# EAGLE schematic Primary (EAGLE 5.12)

## Sheet 1 of 4
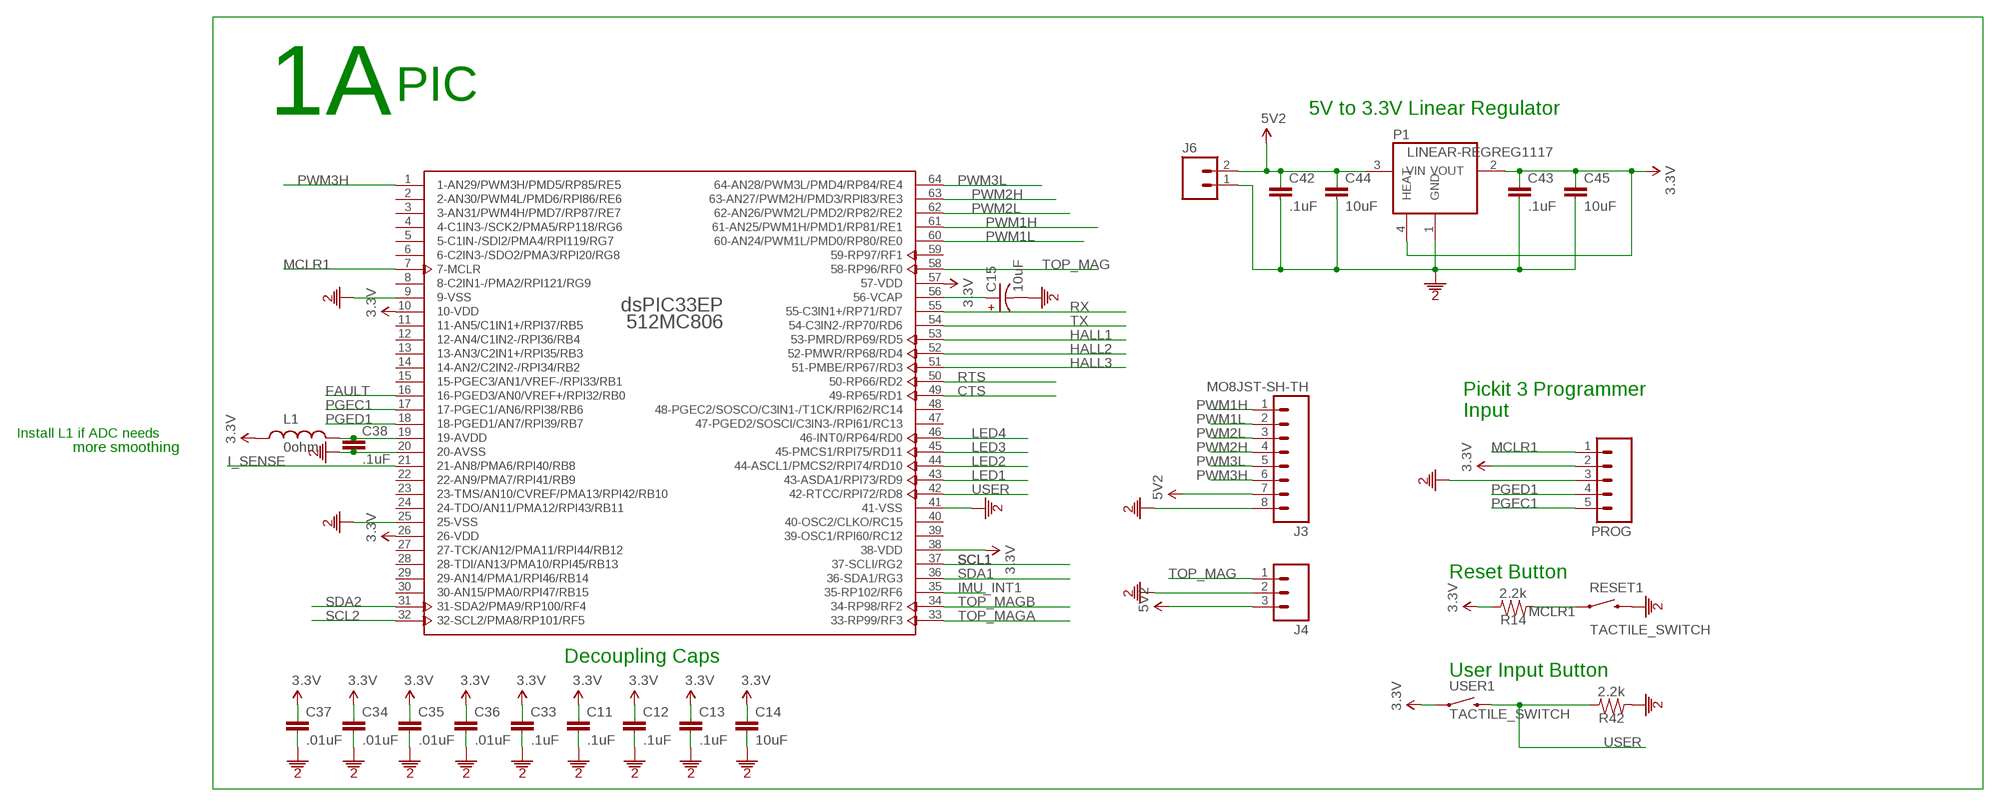
[diagram p0: schematic, sheet 1]

### Parts
C11  .1uF  CAP0603  [0603]
C12  .1uF  CAP0603  [0603]
C13  .1uF  CAP0603  [0603]
C14  10uF  CAP1206  [1206]
C15  10uF  CAP-POL0603  [0603-POL]
C33  .1uF  CAP0603  [0603]
C34  .01uF  CAP0603  [0603]
C35  .01uF  CAP0603  [0603]
C36  .01uF  CAP0603  [0603]
C37  .01uF  CAP0603  [0603]
C38  .1uF  CAP0603  [0603]
C42  .1uF  CAP0603  [0603]
C43  .1uF  CAP0603  [0603]
C44  10uF  CAP1206  [1206]
C45  10uF  CAP1206  [1206]
J3  MO8JST-SH-TH  MO8JST-PH-TH  [JST-8-PH-TH]
J4  M03PH-TH  [JST-3-PH-TH]
J6  M02JST-2-PH-TH  [JST-2-PH-TH]
L1  0ohm  INDUCTOR0603  [0603]
P1  LINEAR-REGREG1117  LINEAR-REG1117  [SOT223]
PIC1  DSPIC33EP512MC806  [TQFP64_10X10]
PROG  M05PTH  [1X05]
R14  2.2k  R0603  [0603]
R42  2.2k  R0603  [0603]
RESET1  TACTILE_SWITCH  [TACTILE_SWITCH]
USER1  TACTILE_SWITCH  [TACTILE_SWITCH]

### Nets
3.3V: C11.1 C12.1 C13.1 C14.1 C33.1 C34.1 C35.1 C36.1 C37.1 C43.1 C45.1 L1.1 P1.2(VOUT) P1.4(HEAT) PIC1.10(10-VDD) PIC1.26(26-VDD) PIC1.38(38-VDD) PIC1.57(57-VDD) PROG.2 R14.2 USER1.1 ; also sheet 2
5V2: C42.1 C44.1 J3.7 J4.3 J6.2 P1.3(VIN) ; also sheet 2,3,4
CTS: PIC1.49(49-RP65/RD1) ; also sheet 2
FAULT: PIC1.16(16-PGED3/AN0/VREF+/RPI32/RB0) ; also sheet 2
GND2: C11.2 C12.2 C13.2 C14.2 C15.- C33.2 C34.2 C35.2 C36.2 C37.2 C38.2 C42.2 C43.2 C44.2 C45.2 J3.8 J4.2 J6.1 P1.1(GND) PIC1.9(9-VSS) PIC1.20(20-AVSS) PIC1.25(25-VSS) PIC1.41(41-VSS) PROG.3 R42.1 RESET1.2 ; also sheet 2,3,4
HALL1: PIC1.53(53-PMRD/RP69/RD5) ; also sheet 2
HALL2: PIC1.52(52-PMWR/RP68/RD4) ; also sheet 2
HALL3: PIC1.51(51-PMBE/RP67/RD3) ; also sheet 2
I_SENSE: PIC1.21(21-AN8/PMA6/RPI40/RB8) ; also sheet 2
IMU_INT1: PIC1.35(35-RP102/RF6) ; also sheet 2
LED1: PIC1.43(43-ASDA1/RPI73/RD9) ; also sheet 2
LED2: PIC1.44(44-ASCL1/PMCS2/RPI74/RD10) ; also sheet 2
LED3: PIC1.45(45-PMCS1/RPI75/RD11) ; also sheet 2
LED4: PIC1.46(46-INT0/RP64/RD0) ; also sheet 2
MCLR1: PIC1.7(7-MCLR) PROG.1 R14.1 RESET1.1
N$15: C38.1 L1.2 PIC1.19(19-AVDD)
N$16: C15.+ PIC1.56(56-VCAP)
PGEC1: PIC1.17(17-PGEC1/AN6/RPI38/RB6) PROG.5
PGED1: PIC1.18(18-PGED1/AN7/RPI39/RB7) PROG.4
PWM1H: J3.1 PIC1.61(61-AN25/PWM1H/PMD1/RP81/RE1) ; also sheet 4
PWM1L: J3.2 PIC1.60(60-AN24/PWM1L/PMD0/RP80/RE0) ; also sheet 4
PWM2H: J3.4 PIC1.63(63-AN27/PWM2H/PMD3/RPI83/RE3) ; also sheet 4
PWM2L: J3.3 PIC1.62(62-AN26/PWM2L/PMD2/RP82/RE2) ; also sheet 4
PWM3H: J3.6 PIC1.1(1-AN29/PWM3H/PMD5/RP85/RE5) ; also sheet 4
PWM3L: J3.5 PIC1.64(64-AN28/PWM3L/PMD4/RP84/RE4) ; also sheet 4
RTS: PIC1.50(50-RP66/RD2) ; also sheet 2
RX: PIC1.55(55-C3IN1+/RP71/RD7) ; also sheet 2
SCL1: PIC1.37(37-SCLI/RG2) ; also sheet 2
SCL2: PIC1.32(32-SCL2/PMA8/RP101/RF5) ; also sheet 2
SDA1: PIC1.36(36-SDA1/RG3) ; also sheet 2
SDA2: PIC1.31(31-SDA2/PMA9/RP100/RF4) ; also sheet 2
TOP_MAG: J4.1 PIC1.58(58-RP96/RF0) ; also sheet 4
TOP_MAGA: PIC1.33(33-RP99/RF3) ; also sheet 2
TOP_MAGB: PIC1.34(34-RP98/RF2) ; also sheet 2
TX: PIC1.54(54-C3IN2-/RP70/RD6) ; also sheet 2
USER: PIC1.42(42-RTCC/RPI72/RD8) R42.2 USER1.2
Unconnected: PIC1.2(2-AN30/PWM4L/PMD6/RPI86/RE6) PIC1.3(3-AN31/PWM4H/PMD7/RP87/RE7) PIC1.4(4-C1IN3-/SCK2/PMA5/RP118/RG6) PIC1.5(5-C1IN-/SDI2/PMA4/RPI119/RG7) PIC1.6(6-C2IN3-/SDO2/PMA3/RPI20/RG8) PIC1.8(8-C2IN1-/PMA2/RPI121/RG9) PIC1.11(11-AN5/C1IN1+/RPI37/RB5) PIC1.12(12-AN4/C1IN2-/RPI36/RB4) PIC1.13(13-AN3/C2IN1+/RPI35/RB3) PIC1.14(14-AN2/C2IN2-/RPI34/RB2) PIC1.15(15-PGEC3/AN1/VREF-/RPI33/RB1) PIC1.22(22-AN9/PMA7/RPI41/RB9) PIC1.23(23-TMS/AN10/CVREF/PMA13/RPI42/RB10) PIC1.24(24-TDO/AN11/PMA12/RPI43/RB11) PIC1.27(27-TCK/AN12/PMA11/RPI44/RB12) PIC1.28(28-TDI/AN13/PMA10/RPI45/RB13) PIC1.29(29-AN14/PMA1/RPI46/RB14) PIC1.30(30-AN15/PMA0/RPI47/RB15) PIC1.39(39-OSC1/RPI60/RC12) PIC1.40(40-OSC2/CLKO/RC15) PIC1.47(47-PGED2/SOSCI/C3IN3-/RPI61/RC13) PIC1.48(48-PGEC2/SOSCO/C3IN1-/T1CK/RPI62/RC14) PIC1.59(59-RP97/RF1)

### Notes on the sheet
- 1 | A | PIC
- 5V to 3.3V Linear Regulator
- Pickit 3 Programmer
- Input
- Install L1 if ADC needs
- more smoothing
- Reset Button
- Decoupling Caps
- User Input Button

## Sheet 2 of 4
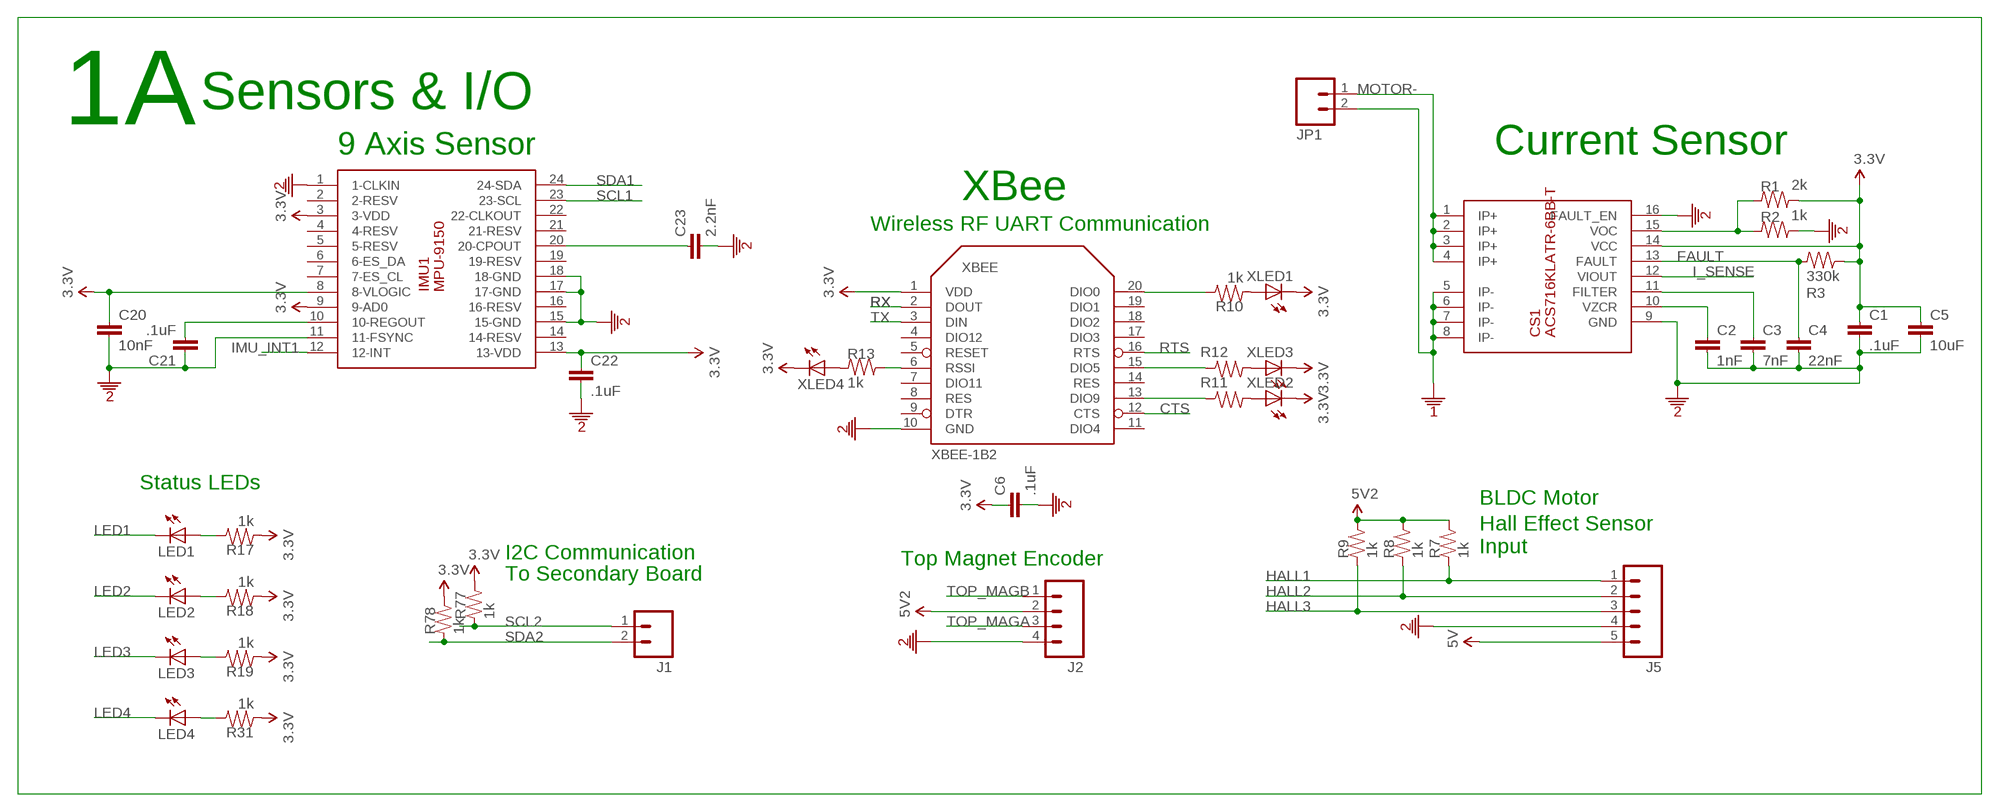
[diagram p1: schematic, sheet 2]

### Parts
C1  .1uF  CAP0603  [0603]
C2  1nF  CAP0603  [0603]
C3  7nF  CAP0603  [0603]
C4  22nF  CAP0603  [0603]
C5  10uF  CAP0603  [0603]
C6  .1uF  CAP1206  [1206]
C20  10nF  CAP0603  [0603]
C21  .1uF  CAP0603  [0603]
C22  .1uF  CAP0603  [0603]
C23  2.2nF  CAP0603  [0603]
CS1  ACS716KLATR-6BB-T  ACS716  [SOIC16-W]
IMU1  MPU-9150  [LGA24_4X4]
J1  M02JST-2-PH-TH  [JST-2-PH-TH]
J2  M04PH-TH  [JST-4-PH-TH]
J5  M05JST-SH  [JST-SH-5]
JP1  M02MINIFITJR  [MOLEX-2-MINIFITJR-RA]
LED1  LED0603  [0603-DIODE]
LED2  LED0603  [0603-DIODE]
LED3  LED0603  [0603-DIODE]
LED4  LED0603  [0603-DIODE]
R1  2k  R0603  [0603]
R2  1k  R0603  [0603]
R3  330k  R0603  [0603]
R7  1k  R0603  [0603]
R8  1k  R0603  [0603]
R9  1k  R0603  [0603]
R10  1k  R0603  [0603]
R11  1k  R0603  [0603]
R12  1k  R0603  [0603]
R13  1k  R0603  [0603]
R17  1k  R0603  [0603]
R18  1k  R0603  [0603]
R19  1k  R0603  [0603]
R31  1k  R0603  [0603]
R77  1k  R0603  [0603]
R78  1k  R0603  [0603]
XBEE  XBEE-1B2  [XBEE-SILK]
XLED1  LED0603  [0603-DIODE]
XLED2  LED0603  [0603-DIODE]
XLED3  LED0603  [0603-DIODE]
XLED4  LED0603  [0603-DIODE]

### Nets
3.3V: C1.1 C5.1 C6.1 C20.1 C22.1 CS1.14(VCC) IMU1.3(3-VDD) IMU1.8(8-VLOGIC) IMU1.9(9-AD0) IMU1.13(13-VDD) R1.2 R3.2 R17.1 R18.1 R19.1 R31.1 R77.2 R78.2 XBEE.1(VDD) XLED1.CAT(C) XLED2.CAT(C) XLED3.CAT(C) XLED4.CAT(C) ; also sheet 1
5V2: J2.2 J5.5 R7.2 R8.2 R9.2 ; supply symbol labelled 5V ; also sheet 1,3,4
CTS: XBEE.12(CTS) ; also sheet 1
FAULT: C4.1 CS1.13(FAULT) R3.1 ; also sheet 1
GND1: CS1.5(IP-) CS1.6(IP-) CS1.7(IP-) CS1.8(IP-) JP1.2 ; also sheet 3,4
GND2: C1.2 C2.2 C3.2 C4.2 C5.2 C6.2 C20.2 C21.1 C22.2 C23.2 CS1.9(GND) CS1.16(FAULT_EN) IMU1.1(1-CLKIN) IMU1.11(11-FSYNC) IMU1.15(15-GND) IMU1.17(17-GND) IMU1.18(18-GND) J2.4 J5.4 R2.2 XBEE.10(GND) ; also sheet 1,3,4
HALL1: J5.1 R7.1 ; also sheet 1
HALL2: J5.2 R8.1 ; also sheet 1
HALL3: J5.3 R9.1 ; also sheet 1
I_SENSE: CS1.12(VIOUT) ; also sheet 1
IMU_INT1: IMU1.12(12-INT) ; also sheet 1
LED1: LED1.CAT(C) ; also sheet 1
LED2: LED2.CAT(C) ; also sheet 1
LED3: LED3.CAT(C) ; also sheet 1
LED4: LED4.CAT(C) ; also sheet 1
MOTOR-: CS1.1(IP+) CS1.2(IP+) CS1.3(IP+) CS1.4(IP+) JP1.1 ; also sheet 4
N$4: R11.2 XBEE.13(DIO9)
N$5: CS1.15(VOC) R1.1 R2.1
N$7: C2.1 CS1.10(VZCR)
N$8: C3.1 CS1.11(FILTER)
N$9: R10.2 XBEE.20(DIO0)
N$10: R10.1 XLED1.AN(A)
N$11: LED1.AN(A) R17.2
N$12: LED2.AN(A) R18.2
N$13: LED3.AN(A) R19.2
N$17: LED4.AN(A) R31.2
N$24: C21.2 IMU1.10(10-REGOUT)
N$25: C23.1 IMU1.20(20-CPOUT)
N$27: R11.1 XLED2.AN(A)
N$30: R12.2 XBEE.15(DIO5)
N$31: R12.1 XLED3.AN(A)
N$32: R13.2 XBEE.6(RSSI)
N$39: R13.1 XLED4.AN(A)
RTS: XBEE.16(RTS) ; also sheet 1
RX: XBEE.2(DOUT) ; also sheet 1
SCL1: IMU1.23(23-SCL) ; also sheet 1
SCL2: J1.1 R77.1 ; also sheet 1
SDA1: IMU1.24(24-SDA) ; also sheet 1
SDA2: J1.2 R78.1 ; also sheet 1
TOP_MAGA: J2.3 ; also sheet 1
TOP_MAGB: J2.1 ; also sheet 1
TX: XBEE.3(DIN) ; also sheet 1
Unconnected: IMU1.2(2-RESV) IMU1.4(4-RESV) IMU1.5(5-RESV) IMU1.6(6-ES_DA) IMU1.7(7-ES_CL) IMU1.14(14-RESV) IMU1.16(16-RESV) IMU1.19(19-RESV) IMU1.21(21-RESV) IMU1.22(22-CLKOUT) XBEE.4(DIO12) XBEE.5(RESET) XBEE.7(DIO11) XBEE.8(RES) XBEE.9(DTR) XBEE.11(DIO4) XBEE.14(RES) XBEE.17(DIO3) XBEE.18(DIO2) XBEE.19(DIO1)

### Notes on the sheet
- 1 | A | Sensors & I/O
- 9 Axis Sensor | Current Sensor
- XBee
- Wireless RF UART Communication
- Status LEDs
- BLDC Motor
- Hall Effect Sensor
- I2C Communication | Input
- Top Magnet Encoder
- To Secondary Board

## Sheet 3 of 4
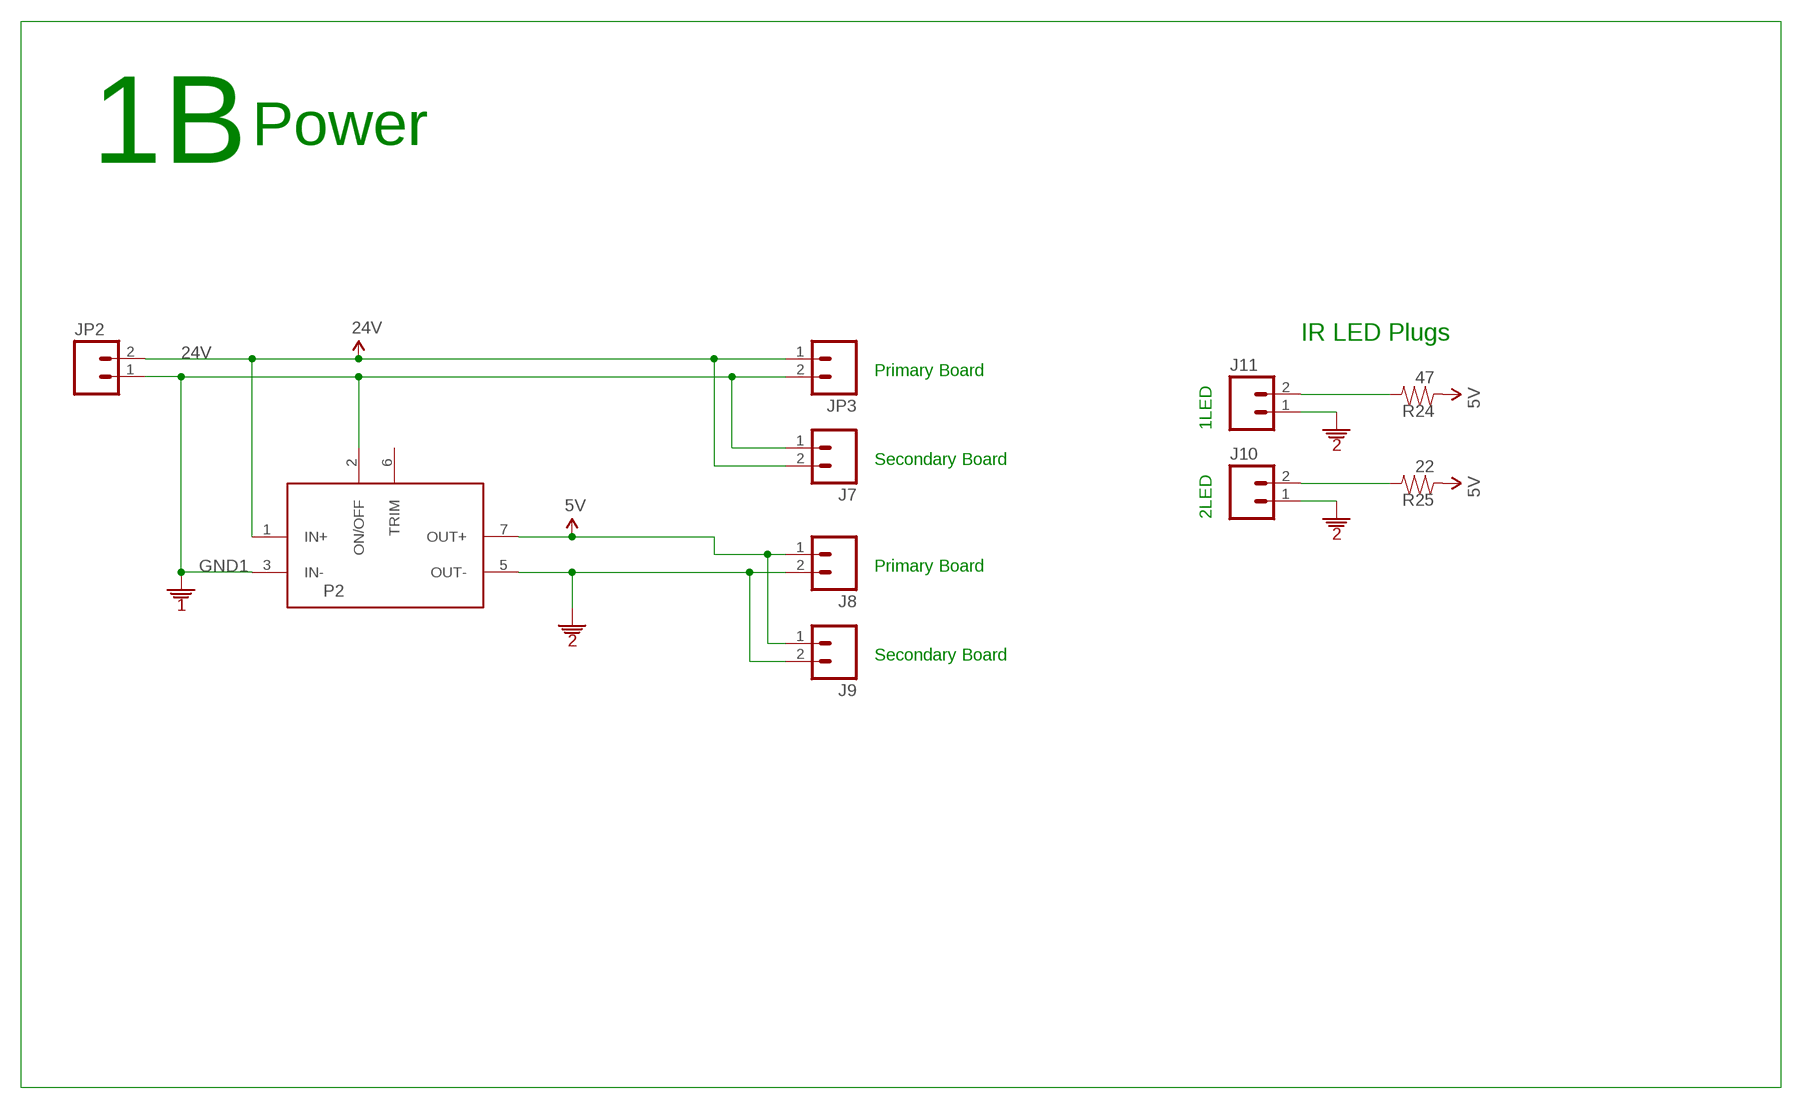
[diagram p2: schematic, sheet 3]

### Parts
J7  M02JST-2-PH-TH  [JST-2-PH-TH]
J8  M02JST-2-PH-TH  [JST-2-PH-TH]
J9  M02JST-2-PH-TH  [JST-2-PH-TH]
J10  M02JST-SH  [JST-SH-2]
J11  M02JST-SH  [JST-SH-2]
JP2  M02MINIFITJR  [MOLEX-2-MINIFITJR-RA]
JP3  M02MINIFITJR  [MOLEX-2-MINIFITJR-RA]
P2  CC10-2405SF-E  DC-DC-CONVERTER2A  [CC10-2405SF-E]
R24  47  R0603  [0603]
R25  22  R0603  [0603]

### Nets
5V2: J8.1 J9.1 P2.7(OUT+) R24.1 R25.1 ; supply symbol labelled 5V ; also sheet 1,2,4
24V: J7.2 JP2.2 JP3.1 P2.1(IN+) ; also sheet 4
GND1: J7.1 JP2.1 JP3.2 P2.2(ON/OFF) P2.3(IN-) ; also sheet 2,4
GND2: J8.2 J9.2 J10.1 J11.1 P2.5(OUT-) ; also sheet 1,2,4
N$18: J11.2 R24.2
N$19: J10.2 R25.2
Unconnected: P2.6(TRIM)

### Notes on the sheet
- 1 | B | Power
- IR LED Plugs
- Primary Board
- 1LED
- Secondary Board
- 2LED
- Primary Board
- Secondary Board

## Sheet 4 of 4
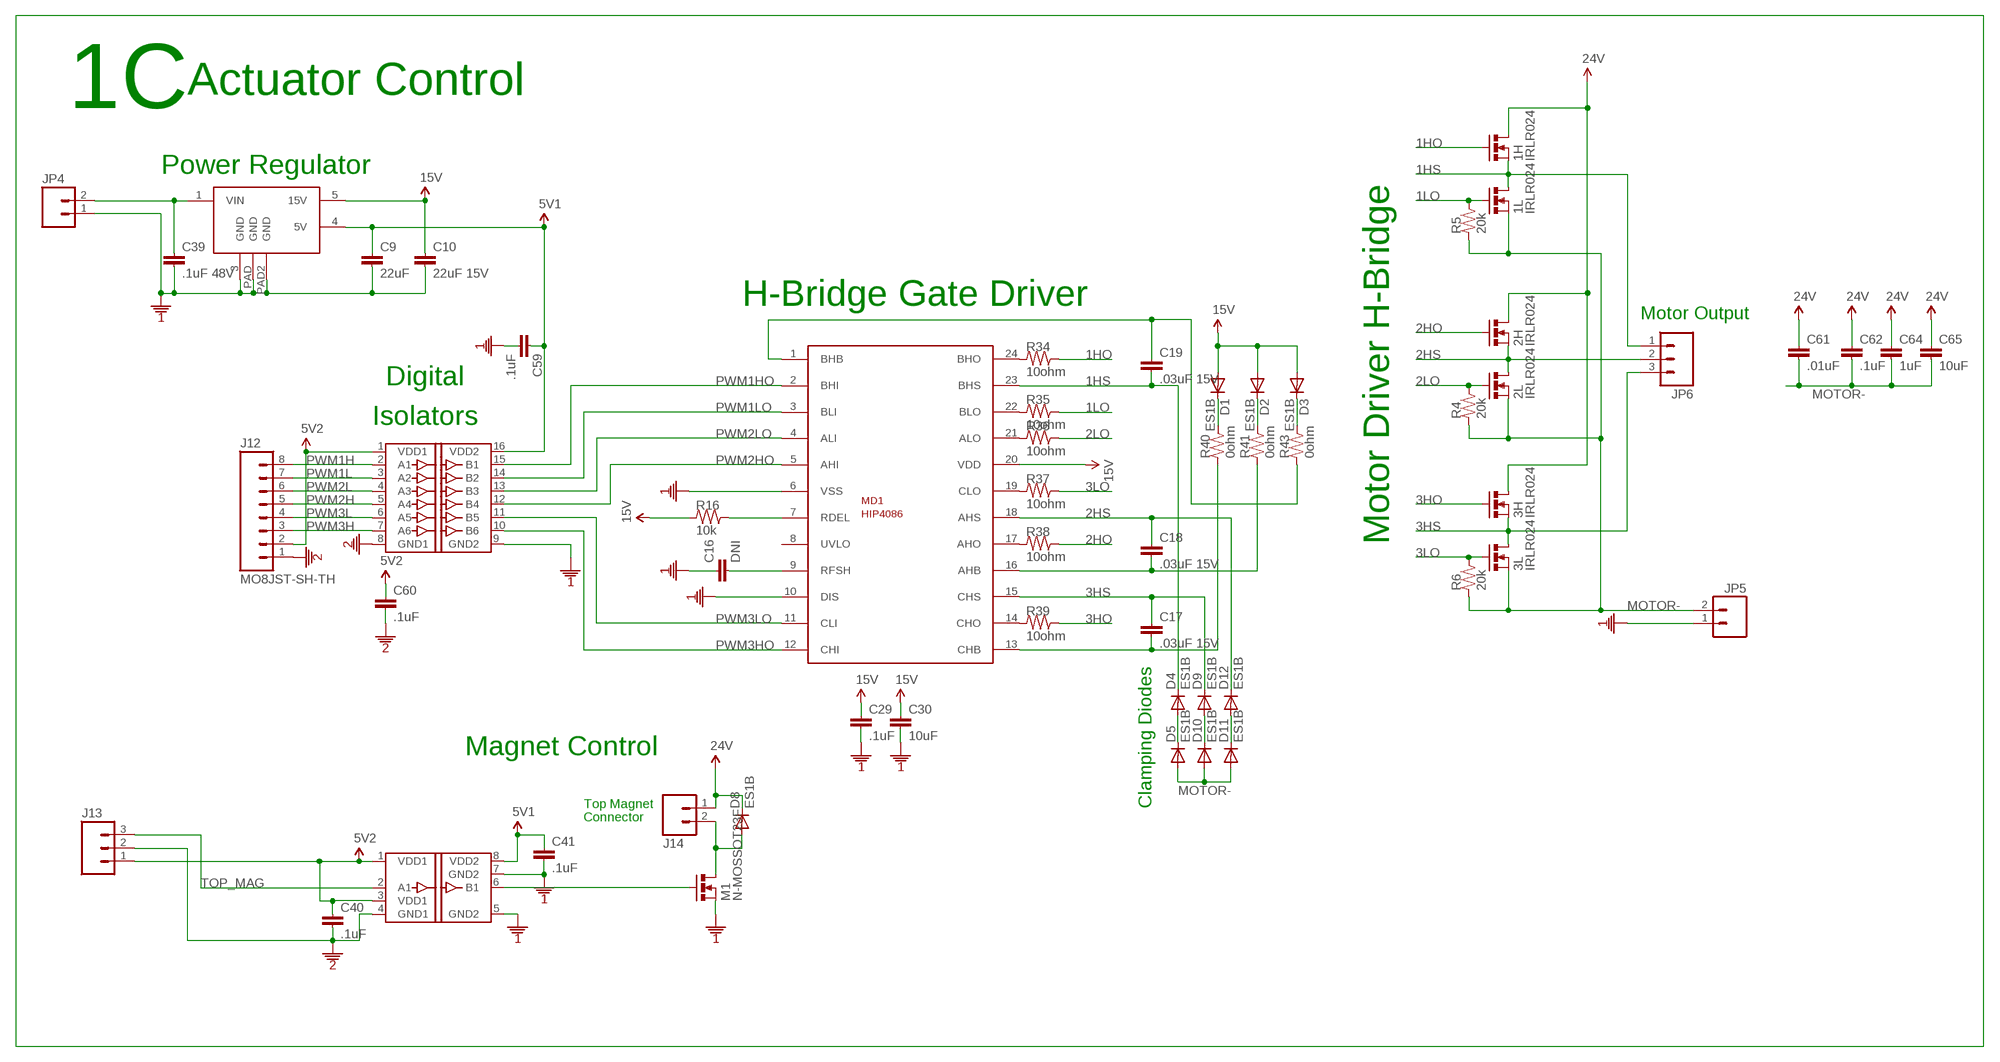
[diagram p3: schematic, sheet 4]

### Parts
1H  IRLR024  N-MOSDPAK  [DPAK]
1L  IRLR024  N-MOSDPAK  [DPAK]
2H  IRLR024  N-MOSDPAK  [DPAK]
2L  IRLR024  N-MOSDPAK  [DPAK]
3H  IRLR024  N-MOSDPAK  [DPAK]
3L  IRLR024  N-MOSDPAK  [DPAK]
C9  22uF  CAP0603  [0603]
C10  22uF 15V  CAP0603  [0603]
C16  DNI  CAP0603  [0603]
C17  .03uF 15V  CAP0603  [0603]
C18  .03uF 15V  CAP0603  [0603]
C19  .03uF 15V  CAP0603  [0603]
C29  .1uF  CAP0603  [0603]
C30  10uF  CAP0603  [0603]
C39  .1uF 48V  CAP0603  [0603]
C40  .1uF  CAP0603  [0603]
C41  .1uF  CAP0603  [0603]
C59  .1uF  CAP0603  [0603]
C60  .1uF  CAP0603  [0603]
C61  .01uF  CAP0603  [0603]
C62  .1uF  CAP0603  [0603]
C64  1uF  CAP1206  [1206]
C65  10uF  CAP1206  [1206]
D1  ES1B  DIODESMA  [SMA-DIODE@1]
D2  ES1B  DIODESMA  [SMA-DIODE@1]
D3  ES1B  DIODESMA  [SMA-DIODE@1]
D4  ES1B  DIODESMA  [SMA-DIODE@1]
D5  ES1B  DIODESMA  [SMA-DIODE@1]
D8  ES1B  DIODESMA  [SMA-DIODE@1]
D9  ES1B  DIODESMA  [SMA-DIODE@1]
D10  ES1B  DIODESMA  [SMA-DIODE@1]
D11  ES1B  DIODESMA  [SMA-DIODE@1]
D12  ES1B  DIODESMA  [SMA-DIODE@1]
DI1  DIGITAL-ISOLATOR-6CH  [SOIC16-N]
DI2  DIGITAL-ISOLATOR-1CHSOIC8-N  [SOIC8-N]
J12  MO8JST-SH-TH  MO8JST-PH-TH  [JST-8-PH-TH]
J13  M03PH-TH  [JST-3-PH-TH]
J14  M02JST-2-PH-TH  [JST-2-PH-TH]
JP4  M02MINIFITJR  [MOLEX-2-MINIFITJR-RA]
JP5  M02MINIFITJR  [MOLEX-2-MINIFITJR-RA]
JP6  M03MINIFITJR  [MOLEX-3-MINIFITJR-RA]
M1  N-MOSSOT23F  [SOT23F]
MD1  HIP4086  [SOIC24-W]
P3  IFX21004TNV51  [TO220-5]
R4  20k  R0603  [0603]
R5  20k  R0603  [0603]
R6  20k  R0603  [0603]
R16  10k  R0603  [0603]
R34  10ohm  R0603  [0603]
R35  10ohm  R0603  [0603]
R36  10ohm  R0603  [0603]
R37  10ohm  R0603  [0603]
R38  10ohm  R0603  [0603]
R39  10ohm  R0603  [0603]
R40  0ohm  R0603  [0603]
R41  0ohm  R0603  [0603]
R43  0ohm  R0603  [0603]

### Nets
1HO: 1H.G R34.2
1HS: 1H.S 1L.D C19.2 D4.C JP6.1 MD1.23(BHS)
1LO: 1L.G R5.2 R35.2
2HO: 2H.G R38.2
2HS: 2H.S 2L.D C18.1 D12.C JP6.2 MD1.18(AHS)
2LO: 2L.G R4.2 R36.2
3HO: 3H.G R39.2
3HS: 3H.S 3L.D C17.1 D9.C JP6.3 MD1.15(CHS)
3LO: 3L.G R6.2 R37.2
5V1: C9.1 C41.1 C59.1 DI1.16(VDD2) DI2.8(VDD2) P3.4(5V)
5V2: C40.1 C60.1 DI1.1(VDD1) DI2.1(VDD1) DI2.3(VDD1) J12.2 J13.1 ; also sheet 1,2,3
15V: C10.1 C29.1 C30.1 D1.A D2.A D3.A MD1.20(VDD) P3.5(15V) R16.1
24V: 1H.D 2H.D 3H.D C39.1 C61.1 C62.1 C64.1 C65.1 D8.C J14.1 JP4.2 P3.1(VIN) ; also sheet 3
GND1: C9.2 C10.2 C16.1 C29.2 C30.2 C39.2 C41.2 C59.2 DI1.9(GND2) DI2.5(GND2) DI2.7(GND2) JP4.1 JP5.1 M1.S MD1.6(VSS) MD1.10(DIS) P3.3(GND) P3.PAD2(GND) P3.PAD(GND) ; also sheet 2,3
GND2: C40.2 C60.2 DI1.8(GND1) DI2.4(GND1) J12.1 J13.2 ; also sheet 1,2,3
MOTOR-: 1L.S 2L.S 3L.S C61.2 C62.2 C64.2 C65.2 D5.A D10.A D11.A JP5.2 R4.1 R5.1 R6.1 ; also sheet 2
N$2: MD1.7(RDEL) R16.2
N$3: C16.2 MD1.9(RFSH)
N$26: MD1.24(BHO) R34.1
N$35: MD1.22(BLO) R35.1
N$36: MD1.21(ALO) R36.1
N$37: MD1.19(CLO) R37.1
N$38: MD1.17(AHO) R38.1
N$48: MD1.14(CHO) R39.1
N$50: C17.2 MD1.13(CHB) R40.1
N$52: C18.2 MD1.16(AHB) R41.1
N$54: C19.1 MD1.1(BHB) R43.1
N$55: D3.C R43.2
N$57: D8.A J14.2 M1.D
N$58: D2.C R41.2
N$59: D1.C R40.2
N$60: D4.A D5.C
N$61: D9.A D10.C
N$62: D11.C D12.A
PWM1H: DI1.2(A1) J12.8 ; also sheet 1
PWM1HO: DI1.15(B1) MD1.2(BHI)
PWM1L: DI1.3(A2) J12.7 ; also sheet 1
PWM1LO: DI1.14(B2) MD1.3(BLI)
PWM2H: DI1.5(A4) J12.5 ; also sheet 1
PWM2HO: DI1.12(B4) MD1.5(AHI)
PWM2L: DI1.4(A3) J12.6 ; also sheet 1
PWM2LO: DI1.13(B3) MD1.4(ALI)
PWM3H: DI1.7(A6) J12.3 ; also sheet 1
PWM3HO: DI1.10(B6) MD1.12(CHI)
PWM3L: DI1.6(A5) J12.4 ; also sheet 1
PWM3LO: DI1.11(B5) MD1.11(CLI)
TOP_MAG: DI2.2(A1) J13.3 ; also sheet 1
TOP_MAGO: DI2.6(B1) M1.G
Unconnected: MD1.8(UVLO)

### Notes on the sheet
- 1 | C | Actuator Control
- Power Regulator
- H-Bridge Gate Driver
- Motor Output
- Digital
- Isolators
- Motor Driver H-Bridge
- Magnet Control
- Top Magnet | Clamping Diodes
- Connector

## Library data of the parts
1H 1L 2H 2L 3H 3L M1 = Gibbot v4:N-MOS
C1-C6 C9-C14 C16-C23 C29 C30 C33-C45 C59-C62 C64 C65 = Gibbot v4:CAP: Capacitor Standard 0603 ceramic capacitor, and 0.1" leaded capacitor.
C15 = Gibbot v4:CAP-POL: CAPACITOR, American symbol
CS1 = Gibbot v4:ACS716
D1-D5 D8-D12 = Gibbot v4:DIODE: Diode These are standard reverse protection diodes and small signal diodes. SMA package can handle up to about 1A. SOD-323 can handle about 200mA. What the SOD-323 package when ordering, there are some mfgs out there that are 5-pin packages.
DI1 = Gibbot v4:DIGITAL-ISOLATOR-6CH
DI2 = Gibbot v4:DIGITAL-ISOLATOR-1CH
IMU1 = Gibbot v4:MPU-9150
J1 J6-J11 J14 JP1-JP5 = Gibbot v4:M02: Header 2 Standard 2-pin 0.1" header. Use with straight break away headers (SKU : PRT-00116), right angle break away headers (PRT-00553), swiss pins (PRT-00743), machine pins (PRT-00117), and female headers (PRT-00115). Molex polarized connector foot print use with SKU : PRT-08233 with associated crimp pins and housings.
J2 = Gibbot v4:M04: Header 4 Standard 4-pin 0.1" header. Use with straight break away headers (SKU : PRT-00116), right angle break away headers (PRT-00553), swiss pins (PRT-00743), machine pins (PRT-00117), and female headers (PRT-00115). Molex polarized connector foot print use with SKU : PRT-08231 with associated crimp pins and housings. 1MM SMD Version SKU: PRT-10208
J3 J12 = Gibbot v4:MO8
J4 J13 JP6 = Gibbot v4:M03: Header 3 Standard 3-pin 0.1" header. Use with straight break away headers (SKU : PRT-00116), right angle break away headers (PRT-00553), swiss pins (PRT-00743), machine pins (PRT-00117), and female headers (PRT-00115). Molex polarized connector foot print use with SKU : PRT-08232 with associated crimp pins and housings.
J5 PROG = Gibbot v4:M05: Header 5 Standard 5-pin 0.1" header. Use with straight break away headers (SKU : PRT-00116), right angle break away headers (PRT-00553), swiss pins (PRT-00743), machine pins (PRT-00117), and female headers (PRT-00115). Molex polarized connector foot print use with SKU : PRT-08230 with associated crimp pins and housings.
L1 = Gibbot v4:INDUCTOR: Inductors Basic Inductor/Choke - 0603 and 1206. Footprints are not proven and vary greatly between part numbers.
LED1-LED4 XLED1-XLED4 = Gibbot v4:LED: LEDs Standard schematic elements and footprints for 5mm, 3mm, 1206, and 0603 sized LEDs. 5mm - Spark Fun Electronics SKU : COM-00529 (and others)
MD1 = Gibbot v4:HIP4086
P1 = Gibbot v4:LINEAR-REG
P2 = Gibbot v4:DC-DC-CONVERTER
P3 = Gibbot v4:IFX21004TNV51
PIC1 = Gibbot v4:DSPIC33EP512MC806
R1-R14 R16-R19 R24 R25 R31 R34-R43 R77 R78 = Gibbot v4:R: RESISTOR, American symbol
RESET1 USER1 = Gibbot v4:TACTILE_SWITCH
XBEE = Gibbot v4:XBEE-1